# EAGLE schematic 3DEC8 (EAGLE 9.4.2)
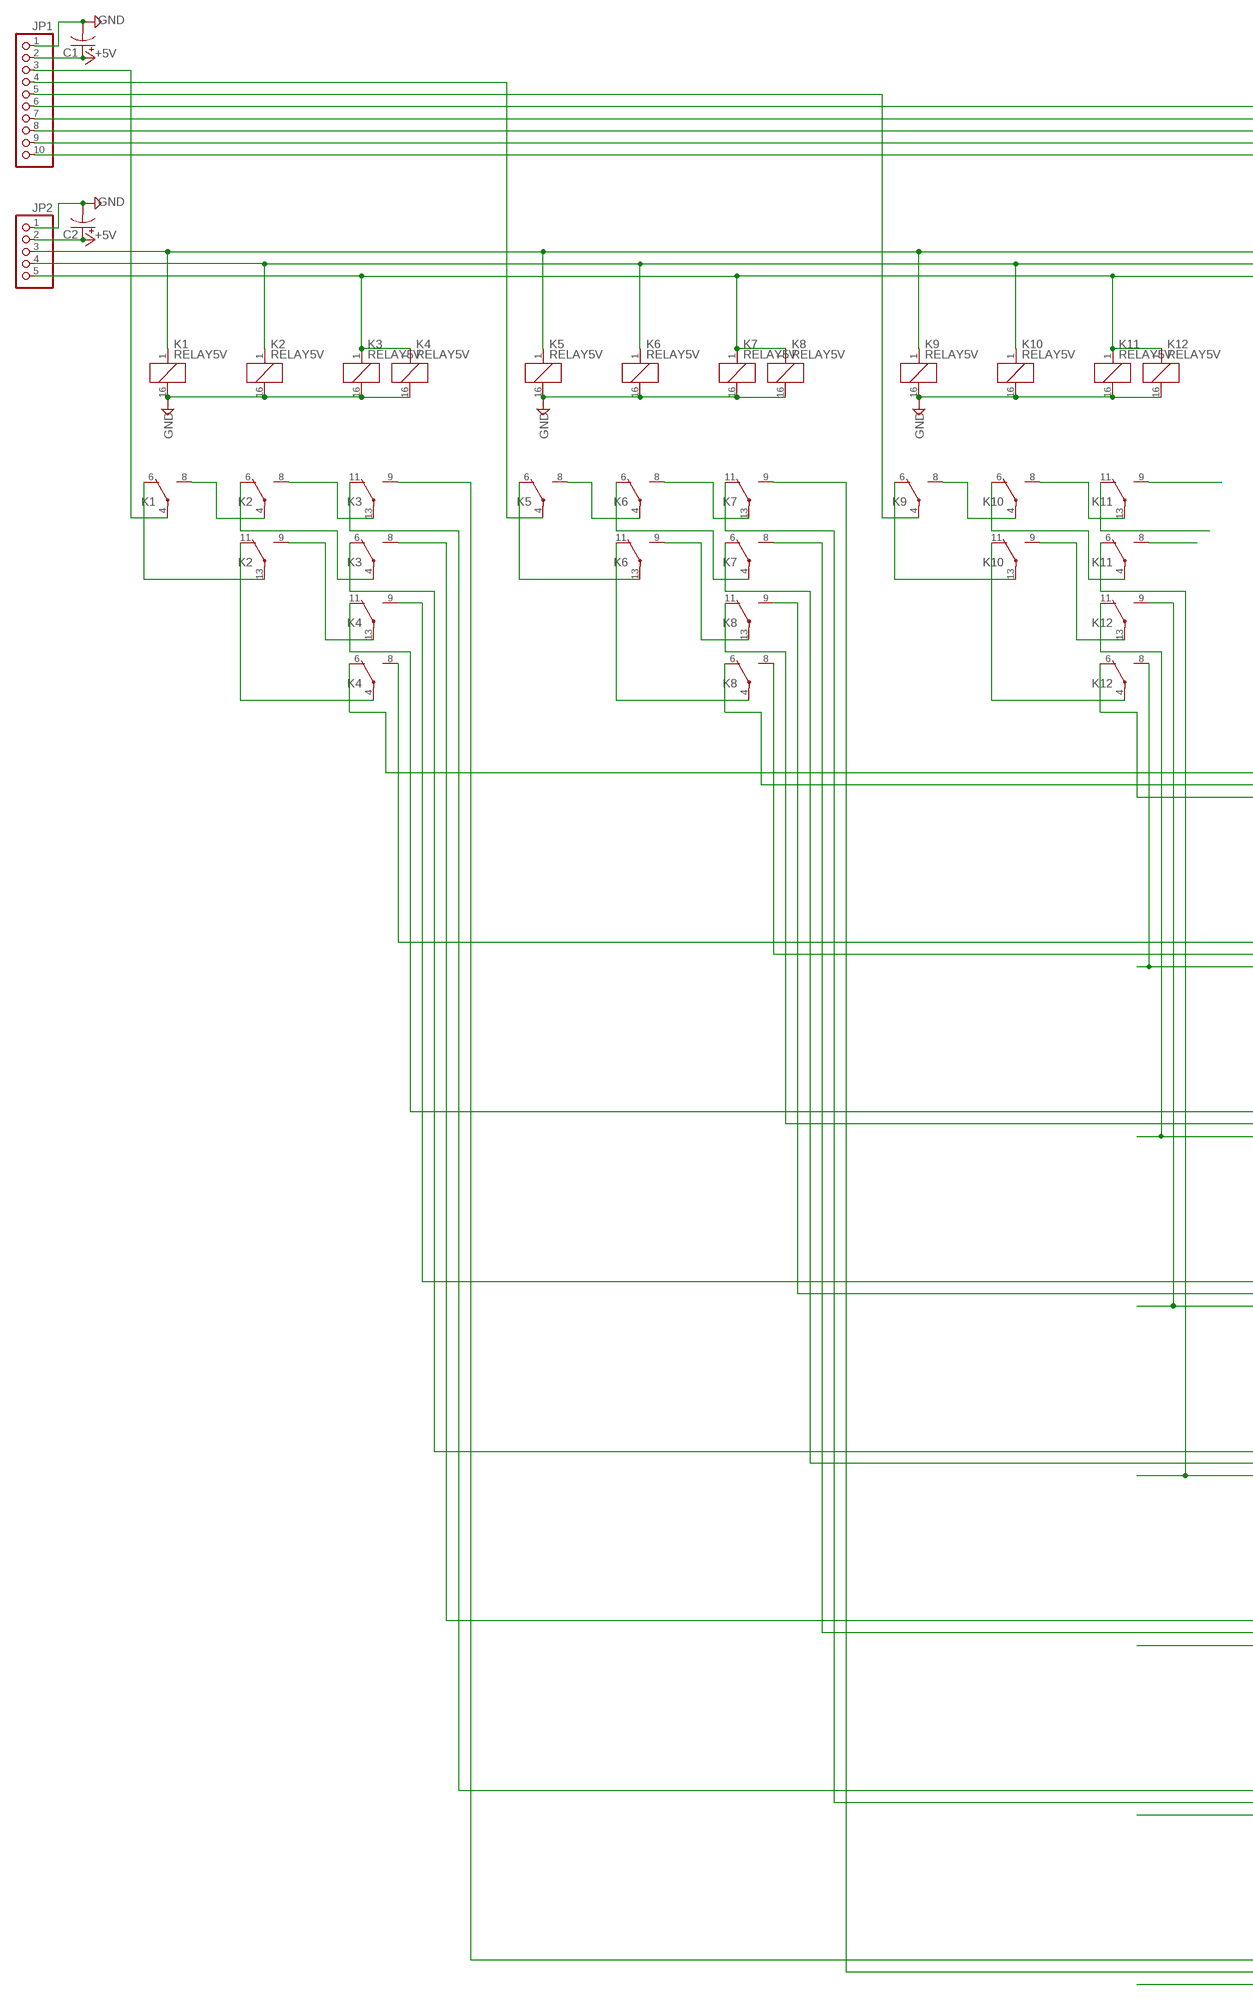
[diagram p0: schematic, sheet 1, part 1 of 2]
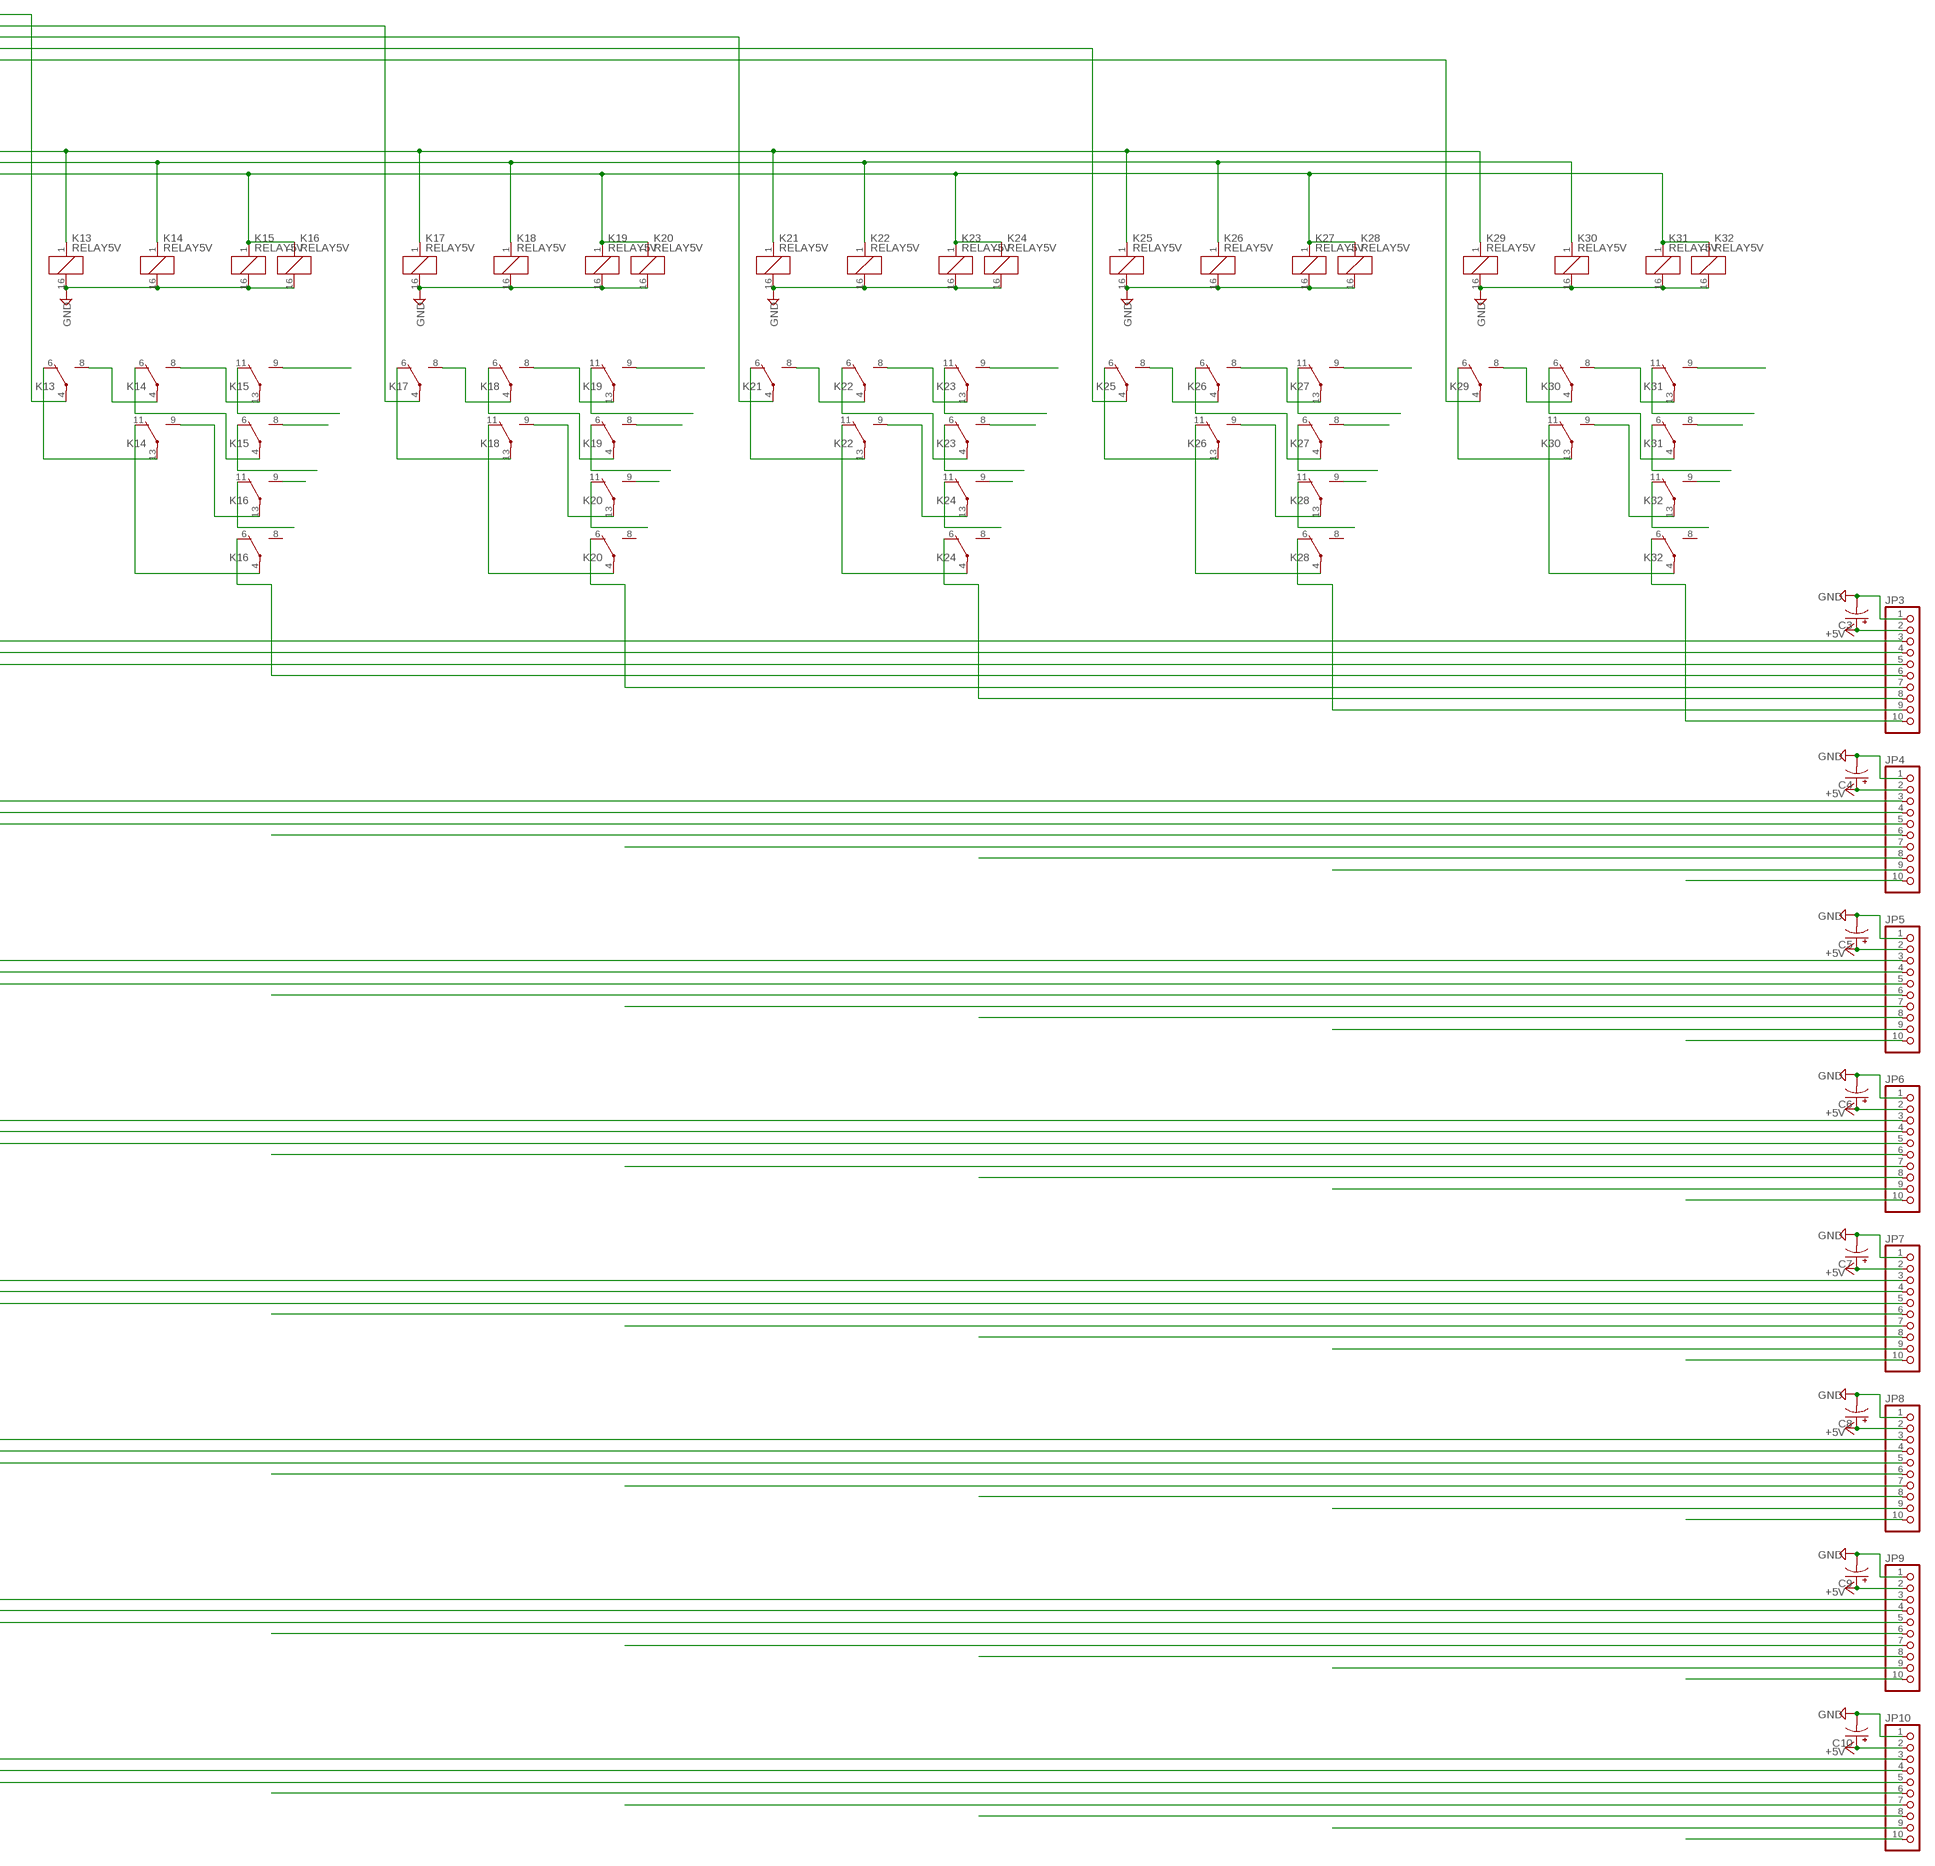
[diagram p1: schematic, sheet 1, part 2 of 2]

## Parts
C1  CC-5-8.5  [E5-8,5]
C2  CC-5-8.5  [E5-8,5]
C3  CC-5-8.5  [E5-8,5]
C4  CC-5-8.5  [E5-8,5]
C5  CC-5-8.5  [E5-8,5]
C6  CC-5-8.5  [E5-8,5]
C7  CC-5-8.5  [E5-8,5]
C8  CC-5-8.5  [E5-8,5]
C9  CC-5-8.5  [E5-8,5]
C10  CC-5-8.5  [E5-8,5]
JP1  PINHD-1X10  [1X10]
JP2  PINHD-1X5  [1X05]
JP3  PINHD-1X10  [1X10]
JP4  PINHD-1X10  [1X10]
JP5  PINHD-1X10  [1X10]
JP6  PINHD-1X10  [1X10]
JP7  PINHD-1X10  [1X10]
JP8  PINHD-1X10  [1X10]
JP9  PINHD-1X10  [1X10]
JP10  PINHD-1X10  [1X10]
K1  RELAY5V  [DS-BT]
K2  RELAY5V  [DS-BT]
K3  RELAY5V  [DS-BT]
K4  RELAY5V  [DS-BT]
K5  RELAY5V  [DS-BT]
K6  RELAY5V  [DS-BT]
K7  RELAY5V  [DS-BT]
K8  RELAY5V  [DS-BT]
K9  RELAY5V  [DS-BT]
K10  RELAY5V  [DS-BT]
K11  RELAY5V  [DS-BT]
K12  RELAY5V  [DS-BT]
K13  RELAY5V  [DS-BT]
K14  RELAY5V  [DS-BT]
K15  RELAY5V  [DS-BT]
K16  RELAY5V  [DS-BT]
K17  RELAY5V  [DS-BT]
K18  RELAY5V  [DS-BT]
K19  RELAY5V  [DS-BT]
K20  RELAY5V  [DS-BT]
K21  RELAY5V  [DS-BT]
K22  RELAY5V  [DS-BT]
K23  RELAY5V  [DS-BT]
K24  RELAY5V  [DS-BT]
K25  RELAY5V  [DS-BT]
K26  RELAY5V  [DS-BT]
K27  RELAY5V  [DS-BT]
K28  RELAY5V  [DS-BT]
K29  RELAY5V  [DS-BT]
K30  RELAY5V  [DS-BT]
K31  RELAY5V  [DS-BT]
K32  RELAY5V  [DS-BT]

## Nets
+5V: C1.+ C2.+ C3.+ C4.+ C5.+ C6.+ C7.+ C8.+ C9.+ C10.+ JP1.2 JP2.2 JP3.2 JP4.2 JP5.2 JP6.2 JP7.2 JP8.2 JP9.2 JP10.2
GND: C1.- C2.- C3.- C4.- C5.- C6.- C7.- C8.- C9.- C10.- JP1.1 JP2.1 JP3.1 JP4.1 JP5.1 JP6.1 JP7.1 JP8.1 JP9.1 JP10.1 K1.16(1:-) K2.16(1:-) K3.16(1:-) K4.16(1:-) K5.16(1:-) K6.16(1:-) K7.16(1:-) K8.16(1:-) K9.16(1:-) K10.16(1:-) K11.16(1:-) K12.16(1:-) K13.16(1:-) K14.16(1:-) K15.16(1:-) K16.16(1:-) K17.16(1:-) K18.16(1:-) K19.16(1:-) K20.16(1:-) K21.16(1:-) K22.16(1:-) K23.16(1:-) K24.16(1:-) K25.16(1:-) K26.16(1:-) K27.16(1:-) K28.16(1:-) K29.16(1:-) K30.16(1:-) K31.16(1:-) K32.16(1:-)
N$1: K1.8(2:S) K2.4(2:P)
N$2: K1.6(2:O) K2.13(3:P)
N$3: K2.8(2:S) K3.13(3:P)
N$4: K2.6(2:O) K3.4(2:P)
N$5: K2.9(3:S) K4.13(3:P)
N$6: K2.11(3:O) K4.4(2:P)
N$7: JP10.3 K3.9(3:S)
N$8: K5.8(2:S) K6.4(2:P)
N$9: JP9.3 K3.11(3:O)
N$10: JP7.3 K3.6(2:O)
N$11: K5.6(2:O) K6.13(3:P)
N$12: JP5.3 K4.11(3:O)
N$13: JP4.4 K8.8(2:S)
N$14: JP4.3 K4.8(2:S)
N$15: JP8.3 K3.8(2:S)
N$16: JP4.5 K12.8(2:S)
N$17: JP6.3 K4.9(3:S)
N$18: K6.8(2:S) K7.13(3:P)
N$19: JP2.3 K1.1(1:+) K5.1(1:+) K9.1(1:+) K13.1(1:+) K17.1(1:+) K21.1(1:+) K25.1(1:+) K29.1(1:+)
N$20: JP2.4 K2.1(1:+) K6.1(1:+) K10.1(1:+) K14.1(1:+) K18.1(1:+) K22.1(1:+) K26.1(1:+) K30.1(1:+)
N$21: K6.6(2:O) K7.4(2:P)
N$22: K6.9(3:S) K8.13(3:P)
N$23: K6.11(3:O) K8.4(2:P)
N$24: JP7.4 K7.6(2:O)
N$25: JP5.4 K8.11(3:O)
N$26: JP3.4 K8.6(2:O)
N$27: JP4.6
N$28: JP4.7
N$29: JP4.8
N$30: JP1.4 K5.4(2:P)
N$31: JP9.4 K7.11(3:O)
N$32: JP3.3 K4.6(2:O)
N$33: JP8.4 K7.8(2:S)
N$34: JP6.4 K8.9(3:S)
N$35: JP1.3 K1.4(2:P)
N$36: JP10.4 K7.9(3:S)
N$37: K9.8(2:S) K10.4(2:P)
N$38: K9.6(2:O) K10.13(3:P)
N$39: K10.8(2:S) K11.13(3:P)
N$40: K10.6(2:O) K11.4(2:P)
N$41: K10.9(3:S) K12.13(3:P)
N$42: K10.11(3:O) K12.4(2:P)
N$43: JP7.5 K11.6(2:O)
N$44: JP5.5 K12.11(3:O)
N$45: JP3.5 K12.6(2:O)
N$46: JP2.5 K3.1(1:+) K4.1(1:+) K7.1(1:+) K8.1(1:+) K11.1(1:+) K12.1(1:+) K15.1(1:+) K16.1(1:+) K19.1(1:+) K20.1(1:+) K23.1(1:+) K24.1(1:+) K27.1(1:+) K28.1(1:+) K31.1(1:+) K32.1(1:+)
N$47: JP4.9
N$48: JP4.10
N$49: JP1.5 K9.4(2:P)
N$50: K11.11(3:O)
N$52: K11.8(2:S)
N$53: JP6.5 K12.9(3:S)
N$54: K11.9(3:S)
N$55: K13.8(2:S) K14.4(2:P)
N$56: K13.6(2:O) K14.13(3:P)
N$57: K14.8(2:S) K15.13(3:P)
N$58: K14.6(2:O) K15.4(2:P)
N$59: K14.9(3:S) K16.13(3:P)
N$60: K14.11(3:O) K16.4(2:P)
N$61: K15.6(2:O)
N$62: K16.11(3:O)
N$63: JP3.6 K16.6(2:O)
N$66: JP5.6
N$67: JP1.6 K13.4(2:P)
N$68: K15.11(3:O)
N$69: JP5.7
N$70: K15.8(2:S)
N$71: K16.9(3:S)
N$72: K15.9(3:S)
N$73: K17.8(2:S) K18.4(2:P)
N$74: K17.6(2:O) K18.13(3:P)
N$75: K18.8(2:S) K19.13(3:P)
N$76: K18.6(2:O) K19.4(2:P)
N$77: K18.9(3:S) K20.13(3:P)
N$78: K18.11(3:O) K20.4(2:P)
N$79: K19.6(2:O)
N$80: K20.11(3:O)
N$81: JP3.7 K20.6(2:O)
N$82: JP5.8
N$83: JP5.9
N$84: JP5.10
N$85: JP1.7 K17.4(2:P)
N$86: K19.11(3:O)
N$88: K19.8(2:S)
N$89: K20.9(3:S)
N$90: K19.9(3:S)
N$91: K21.8(2:S) K22.4(2:P)
N$92: K21.6(2:O) K22.13(3:P)
N$93: K22.8(2:S) K23.13(3:P)
N$94: K22.6(2:O) K23.4(2:P)
N$95: K22.9(3:S) K24.13(3:P)
N$96: K22.11(3:O) K24.4(2:P)
N$97: K23.6(2:O)
N$98: K24.11(3:O)
N$99: JP3.8 K24.6(2:O)
N$102: JP6.6
N$103: JP1.8 K21.4(2:P)
N$104: K23.11(3:O)
N$105: JP6.7
N$106: K23.8(2:S)
N$107: K24.9(3:S)
N$108: K23.9(3:S)
N$109: K25.8(2:S) K26.4(2:P)
N$110: K25.6(2:O) K26.13(3:P)
N$111: K26.8(2:S) K27.13(3:P)
N$112: K26.6(2:O) K27.4(2:P)
N$113: K26.9(3:S) K28.13(3:P)
N$114: K26.11(3:O) K28.4(2:P)
N$115: K27.6(2:O)
N$116: K28.11(3:O)
N$117: JP3.9 K28.6(2:O)
N$118: JP6.8
N$119: JP6.9
N$120: JP6.10
N$121: JP1.9 K25.4(2:P)
N$122: K27.11(3:O)
N$124: K27.8(2:S)
N$125: K28.9(3:S)
N$126: K27.9(3:S)
N$127: K29.8(2:S) K30.4(2:P)
N$128: K29.6(2:O) K30.13(3:P)
N$129: K30.8(2:S) K31.13(3:P)
N$130: K30.6(2:O) K31.4(2:P)
N$131: K30.9(3:S) K32.13(3:P)
N$132: K30.11(3:O) K32.4(2:P)
N$133: K31.6(2:O)
N$134: K32.11(3:O)
N$135: JP3.10 K32.6(2:O)
N$138: JP7.6
N$139: JP1.10 K29.4(2:P)
N$140: K31.11(3:O)
N$141: JP7.7
N$142: K31.8(2:S)
N$143: K32.9(3:S)
N$144: K31.9(3:S)
N$145: JP7.8
N$146: JP7.9
N$147: JP7.10
N$150: JP8.5
N$151: JP8.6
N$152: JP8.7
N$153: JP8.8
N$154: JP8.9
N$155: JP8.10
N$158: JP9.5
N$159: JP9.6
N$160: JP9.7
N$161: JP9.8
N$162: JP9.9
N$163: JP9.10
N$166: JP10.5
N$167: JP10.6
N$168: JP10.7
N$169: JP10.8
N$170: JP10.9
N$171: JP10.10
Unconnected: K1.9(3:S) K1.11(3:O) K1.13(3:P) K5.9(3:S) K5.11(3:O) K5.13(3:P) K9.9(3:S) K9.11(3:O) K9.13(3:P) K13.9(3:S) K13.11(3:O) K13.13(3:P) K16.8(2:S) K17.9(3:S) K17.11(3:O) K17.13(3:P) K20.8(2:S) K21.9(3:S) K21.11(3:O) K21.13(3:P) K24.8(2:S) K25.9(3:S) K25.11(3:O) K25.13(3:P) K28.8(2:S) K29.9(3:S) K29.11(3:O) K29.13(3:P) K32.8(2:S)

## Library data of the parts
C1-C10 = Passive_Robotech:CC
JP1 JP3-JP10 = pinhead:PINHD-1X10: PIN HEADER
JP2 = pinhead:PINHD-1X5: PIN HEADER
K1-K32 = My:RELAY: DS-BT RELAYS 4,000 V BREAKDOWN VOLTAGE NAiS Source: http://www.mew-europe.com/.. en_ds_61005_0010.pdf

## Net classes
0 default: width 0.406 mm